# Altium schematic sheet STB_UID.SchDoc: STB Sensor Board - UID
size A4; Author: flmoll / gruprecht; DrawnBy: flmoll / gruprecht; Organization: PBL; Revision: A; SheetNumber: 7; SheetTotal: 8
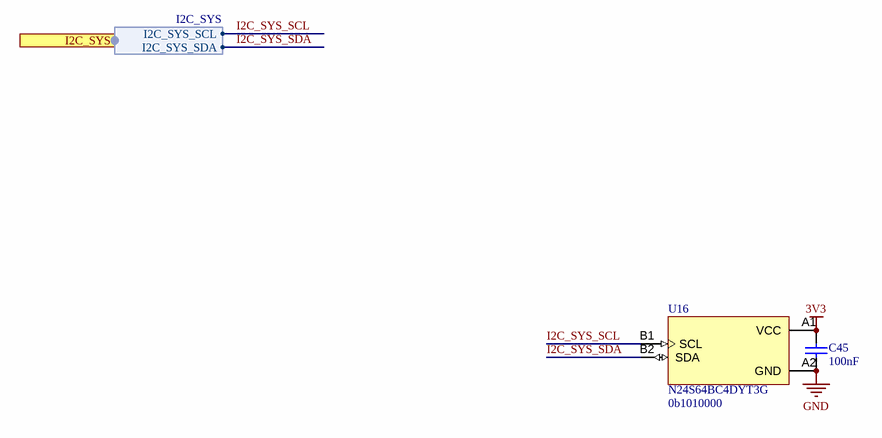
[diagram p0: STB_UID.SchDoc]

## Parts
C45  100nF  [CAPC1050X55X23LL05T13]
U16  N24S64BC4DYT3G  [4-WLCSP (0.77x0.77)]

## Ports
I2C_SYS (harness I2C_SYS)

## Harnesses
I2C_SYS: I2C_SYS_SDA, I2C_SYS_SCL

## Nets
3V3: C45.2 U16.A1(VCC)
GND: C45.1 U16.A2(GND)
I2C_SYS_SCL: U16.B1(SCL) ; port I2C_SYS.I2C_SYS_SCL
I2C_SYS_SDA: U16.B2(SDA) ; port I2C_SYS.I2C_SYS_SDA

## Notes on the sheet
- (near U16) 0b1010000
- 1
- 2
- 3
- 4
- A
- B
- C
- Project:
- D
- Date:
- Drawing number:
- Rev:
- Format:
- A4 Q
- Drawn by:
- Laboratory:
- Page
- Sheet:
- of
- File:

## Library data of the parts
C45 = CMP-2000-05439-1: Chip Capacitor, 100 nF, +/- 10%, 16 V, -55 to 125 degC, 0402 (1005 Metric), RoHS, Tape and Reel; Manufacturer: Samsung Electro-Mechanics; Manufacturer Part Number: CL05B104KO5NNNC; Dielectric: X7R; Rated Voltage: 16V; Dielectric Material: Ceramic; Multilayer: Yes; Case Size/Dimension: 0402; Tolerance (%): ±10%; Value: 100nF; Manufacturer URL: http://www.samsungsem.com/global/index.jsp; Datasheet URL: https://datasheet.ciiva.com/29198/458718-da-01-en-vs-kondensator-0402-29198423.pdf; Datasheet Version: Nov-10; Supplier 1: Digi-Key; Supplier Part Number 1: 1276-1001-6-ND; RoHS: Yes; Category: Ceramic Capacitors; Stock 1: 24854634; Pricing 1: 1=0.10000, 10=0.02400, 50=0.01300, 100=0.01050, 500=0.00752, 1000=0.00592, 2500=0.00538, 5000=0.00495 (USD); Mount: Surface Mount; Number of Pins: 2; Package Shape: Rectangular; Size Code: 0402; Terminal Finish: Nickel; Min Operating Temperature: -55°C; Max Operating Temperature: 125°C; JESD-609 Code: e3; Capacitor Type: Ceramic; Negative Tolerance: 10%; Packaging: Tape and Reel; Positive Tolerance: 10%; Rated DC Voltage (URdc): 16V; Temperature Characteristics Code: X7R; Termination: Wraparound; Package Style: SMTMeter; Length: 1mm; Width: 0.5mm; Height: 0.55mm; REACH SVHC: Yes; RoHS Compliant: Yes; ComponentLink1URL: https://datasheet.ciiva.com:443/pdfs/VipMasterIC/IC/SEMS/SEMS-S-A0008384515/SEMS-S-A0008872921-1.pdf?src-supplier=IHS+Markit; ComponentLink1Description: https://datasheet.ciiva.com:443/pdfs/VipMasterIC/IC/SEMS/SEMS-S-A0008384515/SEMS-S-A0008872921-1.pdf?src-supplier=IHS+Markit; ComponentLink2URL: https://datasheet.ciiva.com/26920/getdatasheetpartid-359683-26920169.pdf?src-supplier=Verical; ComponentLink2Description: https://datasheet.ciiva.com/26920/getdatasheetpartid-359683-26920169.pdf?src-supplier=Verical; ComponentLink3URL: https://datasheet.ciiva.com/29198/458718-da-01-en-vs-kondensator-0402-29198423.pdf?src-supplier=Conrad; ComponentLink3Description: https://datasheet.ciiva.com/29198/458718-da-01-en-vs-kondensator-0402-29198423.pdf?src-supplier=Conrad; ComponentLink4URL: https://datasheet.ciiva.com/26309/mlcc-catalogdownload2013-eng-26309003.pdf?src-supplier=Distrelec; ComponentLink4Description: https://datasheet.ciiva.com/26309/mlcc-catalogdownload2013-eng-26309003.pdf?src-supplier=Distrelec; ComponentLink5URL: https://datasheet.ciiva.com/16208/cl05b104kq5nnnc-16208343.pdf?src-supplier=Future+Electronics; ComponentLink5Description: https://datasheet.ciiva.com/16208/cl05b104kq5nnnc-16208343.pdf?src-supplier=Future+Electronics
U16 = CMP-02089-1: Memory IC 64Kb (8K x 8) I²C 1 MHz 400 ns 4-WLCSP (0.77x0.77); Mfr: onsemi; Manufacturer: ON Semiconductor; Product Status: Active; Memory Type: Non-Volatile; Memory Format: EEPROM; Clock Frequency: 1 MHz; Write Cycle Time - Word, Page: 5ms; Access Time: 400 ns; Voltage - Supply: 1.7V ~ 5.5V; Base Product Number: N24S64; Description: EEPROM, 8KX8, Serial, CMOS, PBGA4; Technology: -; Memory Size: 64Kb (8K x 8); Memory Interface: I²C; Operating Temperature: -40°C ~ 85°C (TA); Mounting Type: Surface Mount; Package / Case: 4-XFBGA, WLCSP; Supplier Device Package: 4-WLCSP (0.77x0.77); Supplier 1: Digi-Key; Supplier Part Number 1: 488-N24S64BC4DYT3GDKR-ND; Manufacturer Part Number: N24S64BC4DYT3G; RoHS: Yes; Category: EEPROM